# Altium schematic sheet M9A_12_3190102060_A.SchDoc
size A4
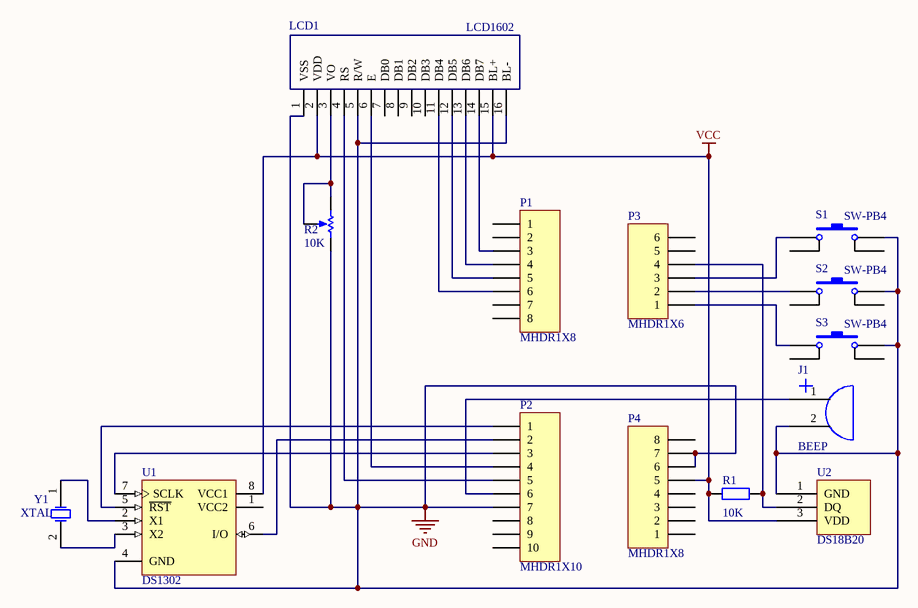
[diagram p0: M9A_12_3190102060_A.SchDoc]

## Parts
J1  BEEP  [Beep]
LCD1  LCD1602  [1602]
P1  MHDR1X8  [HDR1X8]
P2  MHDR1X10  [HDR1X10]
P3  MHDR1X6  [HDR1X6]
P4  MHDR1X8  [HDR1X8]
R1  value 10K  [AXIAL-0.4]  (hidden comment: Res2)
R2  value 10K  [VR_A1]  (hidden comment: RPot)
S1  SW-PB4  [AN-S]
S2  SW-PB4  [AN-S]
S3  SW-PB4  [AN-S]
U1  DS1302  [DIP8]
U2  DS18B20  [TO-92A]
Y1  XTAL  [R38]

## Nets
GND: J1.2 LCD1.1(VSS) LCD1.5(R/W) LCD1.16(BL-) P2.7 P4.6 P4.7 R2.3(BOT) S1.2 S2.2 S3.2 U1.4(GND) U2.1(GND)
VCC: LCD1.2(VDD) LCD1.15(BL+) P4.5 R1.1 U1.8(VCC1) U2.3(VDD)
NetJ1_1: J1.1 P2.6
NetLCD1_3: LCD1.3(VO) R2.1(TOP) R2.2(TAP)
NetLCD1_4: LCD1.4(RS) P2.5
NetLCD1_6: LCD1.6(E) P2.4
NetLCD1_11: LCD1.11(DB4) P1.6
NetLCD1_12: LCD1.12(DB5) P1.5
NetLCD1_13: LCD1.13(DB6) P1.4
NetLCD1_14: LCD1.14(DB7) P1.3
NetP2_1: P2.1 U1.5(~{RST})
NetP2_2: P2.2 U1.6(I/O)
NetP2_3: P2.3 U1.7(SCLK)
NetP3_1: P3.1 S3.1
NetP3_2: P3.2 S2.1
NetP3_3: P3.3 S1.1
NetP3_4: P3.4 R1.2 U2.2(DQ)
NetU1_2: U1.2(X1) Y1.1(OSC1)
NetU1_3: U1.3(X2) Y1.2(OSC2)

Not connected (* = marked no-connect by the designer): LCD1 7(DB0) 8(DB1) 9(DB2) 10(DB3); P1 1 2 7 8; P2 8 9 10; P3 5 6; P4 1 2 3 4 8; S1 3 4; S2 3 4; S3 3 4; U1 1(VCC2)

## Library data of the parts
J1 = BEEP: 蜂鸣器
P1 P4 = MHDR1X8: Header, 8-Pin; LatestRevisionDate: 17-Jul-2002; LatestRevisionNote: Re-released for DXP Platform.; Publisher: Altium Limited
P2 = MHDR1X10: Header, 10-Pin; LatestRevisionDate: 17-Jul-2002; LatestRevisionNote: Re-released for DXP Platform.; Publisher: Altium Limited
P3 = MHDR1X6: Header, 6-Pin; LatestRevisionDate: 17-Jul-2002; LatestRevisionNote: Re-released for DXP Platform.; Publisher: Altium Limited
R1 = Res2: Resistor; Published: 8-Jun-2000; LatestRevisionDate: 17-Jul-2002; LatestRevisionNote: Re-released for DXP Platform.; PackageReference: AXIAL-0.4; Publisher: Altium Limited
R2 = RPot: 精密可调电阻; Sim Note: Enter the Resistance value and the set point into parameter fields.; Set Position: 0.5; Published: 8-Jun-2000; LatestRevisionDate: 17-Jul-2002; LatestRevisionNote: Re-released for DXP Platform.; PackageReference: VR5; Publisher: Altium Limited
S1-S3 = SW-PB4: 微动开关; Published: 24-Mar-1999; LatestRevisionDate: 17-Jul-2002; LatestRevisionNote: Re-released for DXP Platform.; PackageReference: SPST-2; Publisher: Altium Limited
U1 = DS1302: Trickle Charge Timekeeping Chip; Published: 13-Oct-2000; LatestRevisionDate: 06-Jun-2005; LatestRevisionNote: Stylized 3D Model Added.; DatasheetVersion: 2-Jul-1999; PackageVersion: 1999; PackageReference: DIP8; Publisher: Altium Limited; PackageDescription: DIP; 8 Leads; Row Spacing 7.62 mm; Pitch 2.54 mm; ComponentLink1Description: Manufacturer Link; ComponentLink1URL: http://www.maxim-ic.com/; ComponentLink2Description: Datasheet; ComponentLink2URL: http://pdfserv.maxim-ic.com/en/ds/DS1302.pdf
U2 = DS18B20: 温度传感器
Y1 = XTAL: Crystal Oscillator; Published: 8-Jun-2000; LatestRevisionDate: 17-Jul-2002; LatestRevisionNote: Re-released for DXP Platform.; PackageReference: R38; Publisher: Altium Limited